# Altium project LedDimming_IR_Horizontal_Tail_BothSize.PrjPcb
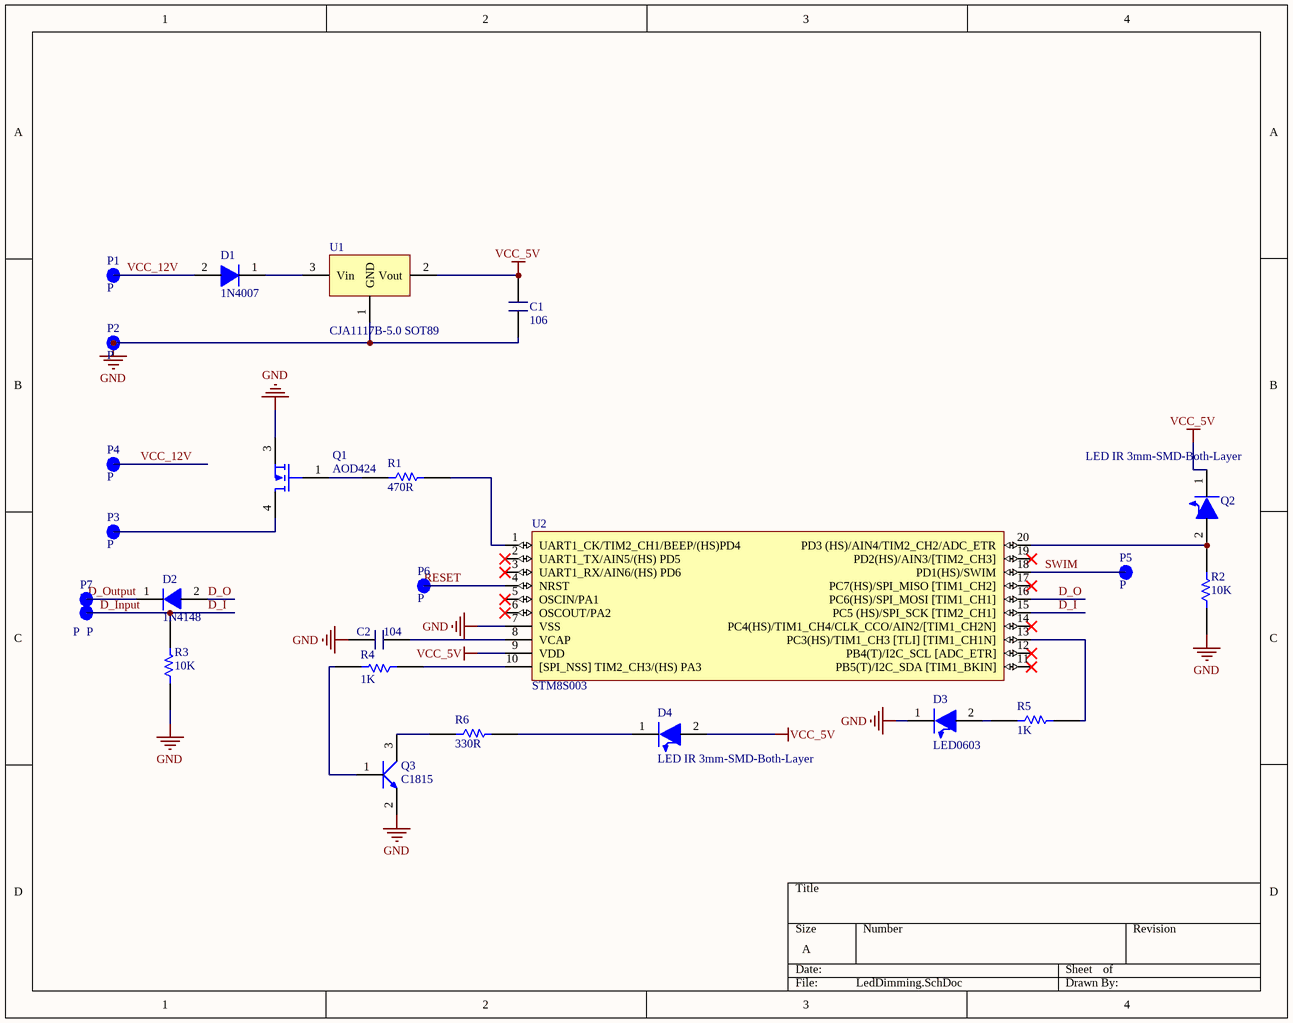
[diagram p0: LedDimming.SchDoc]
1 sheet, 25 parts. Net scope: global (net labels, ports and power ports of the same name join across sheets).
Board file: LedDimming_IR_Horizontal_Tail_BothSize.PcbDoc

## Sheet LedDimming.SchDoc
size A

### Parts
C1  106  [CAPC2012X12N]
C2  104  [CAPC2012X12N]
D1  1N4007  [SODFL504X244-2N]
D2  1N4148  [DIOMELF3515N]
D3  LED0603  [DIOC1608X06N]
D4  LED IR 3mm-SMD-Both-Layer  [LED_IR_3mm-SMD-Both_Layer]
P1  P  [Point]
P2  P  [Point]
P3  P  [Point]
P4  P  [Point]
P5  P  [Point]
P6  P  [Point]
P7  P  [Point]
P8  P  [Point]
Q1  AOD424  [DPAK228P991X229-3N_TO252]
Q2  LED IR 3mm-SMD-Both-Layer  [LED_IR_3mm-SMD-Both_Layer]
Q3  C1815  [SOT95P278X125-3N]
R1  470R  [RESC2608X06N_0603]
R2  10K  [RESC2608X06N_0603]
R3  10K  [RESC2608X06N_0603]
R4  1K  [RESC2608X06N_0603]
R5  1K  [RESC2608X06N_0603]
R6  330R  [RESC2608X06N_0603]
U1  CJA1117B-5.0 SOT89  [SOT89-150P409X160-3N]
U2  STM8S003  [TSOP65P640X120-20N]

### Nets
GND: C1.1 C2.1 D3.1(A) P2.1 Q1.3(S) Q3.2(E) R2.1 R3.1 U1.1(GND) U2.7(VSS)
VCC_5V: C1.2 D4.2(C) Q2.1(A) U1.2(Vout) U2.9(VDD)
D_I: P8.1 R3.2 U2.15(PC5_(HS)/SPI_SCK_[TIM2_CH1])  [also labelled D_Input]
D_O: D2.2(A) U2.16(PC6(HS)/SPI_MOSI_[TIM1_CH1])
D_Output: D2.1(C) P7.1
RESET: P6.1 U2.4(NRST)
SWIM: P5.1 U2.18(PD1(HS)/SWIM)
VCC_12V: D1.2(A) P1.1 P4.1
NetC2_2: C2.2 U2.8(VCAP)
NetD1_1: D1.1(C) U1.3(Vin)
NetD3_2: D3.2(C) R5.1
NetD4_1: D4.1(A) R6.2
NetP3_1: P3.1 Q1.4(D)
NetQ1_1: Q1.1(G) R1.1
NetQ2_2: Q2.2(C) R2.2 U2.20(PD3_(HS)/AIN4/TIM2_CH2/ADC_ETR)
NetQ3_1: Q3.1(B) R4.2
NetQ3_3: Q3.3(C) R6.1
NetR1_2: R1.2 U2.1(UART1_CK/TIM2_CH1/BEEP/(HS)PD4)
NetR4_1: R4.1 U2.10([SPI_NSS]_TIM2_CH3/(HS)_PA3)
NetR5_2: R5.2 U2.13(PC3(HS)/TIM1_CH3_[TLI]_[TIM1_CH1N])

Not connected (* = marked no-connect by the designer): U2 2(UART1_TX/AIN5/(HS)_PD5)* 3(UART1_RX/AIN6/(HS)_PD6)* 5(OSCIN/PA1)* 6(OSCOUT/PA2)* 11(PB5(T)/I2C_SDA_[TIM1_BKIN])* 12(PB4(T)/I2C_SCL_[ADC_ETR])* 14(PC4(HS)/TIM1_CH4/CLK_CCO/AIN2/[TIM1_CH2N])* 17(PC7(HS)/SPI_MISO_[TIM1_CH2])* 19(PD2(HS)/AIN3/[TIM2_CH3])*

### Library data of the parts
C1 = Capacitor 106
C2 = Capacitor 104 0603
D1 = 1N4007_SMD Diode: 1N4007_SMD
D2 = 1N4148_SMD: DIODE GEN PURP 75V 200MA DO213AA; Supplier 1: Digi-Key; Supplier Part Number 1: 1N4148UR-1-ND
P1-P8 = Point
Q1 = AOD424 20V N-Channel MOSFET
Q3 = Transitor C1815 NPN: SOT-23 Plastic-Encapsulate Transistors
R1 = R470_0603_5%: Thick Film Resistors - SMD 470 ohm 5%; Supplier 1: Digi-Key; Supplier Part Number 1: CR0603-JW-471ELFCT-ND
R2 R3 = R10k_0603_5%: RES SMD 10K OHM 1% 1/4W 0603; Supplier 1: Digi-Key; Supplier Part Number 1: 541-10.0KSCT-ND
R4 R5 = 1k_0603_5%: Thick Film Resistors - SMD 0603 1kOHMS 5% 1/10WATT; Supplier 1: Digi-Key; Supplier Part Number 1: CR0603-JW-101ELFCT-ND
R6 = R330_0603_5%: Thick Film Resistors - SMD 330 ohm 5%; Supplier 1: Digi-Key; Supplier Part Number 1: CR0603-JW-471ELFCT-ND
U1 = CJA1117B-5.0 SOT89: CJA1117B-5.0 SOT89 Power IC 1A 5V_IC
U2 = STM8S003: MCU 8-bit STM8S STM8 CISC 8KB Flash 3.3V/5V 20-Pin TSSOP T/R; Value: STM8S003F3; Supplier Part Number 1: 497-18051-1-ND